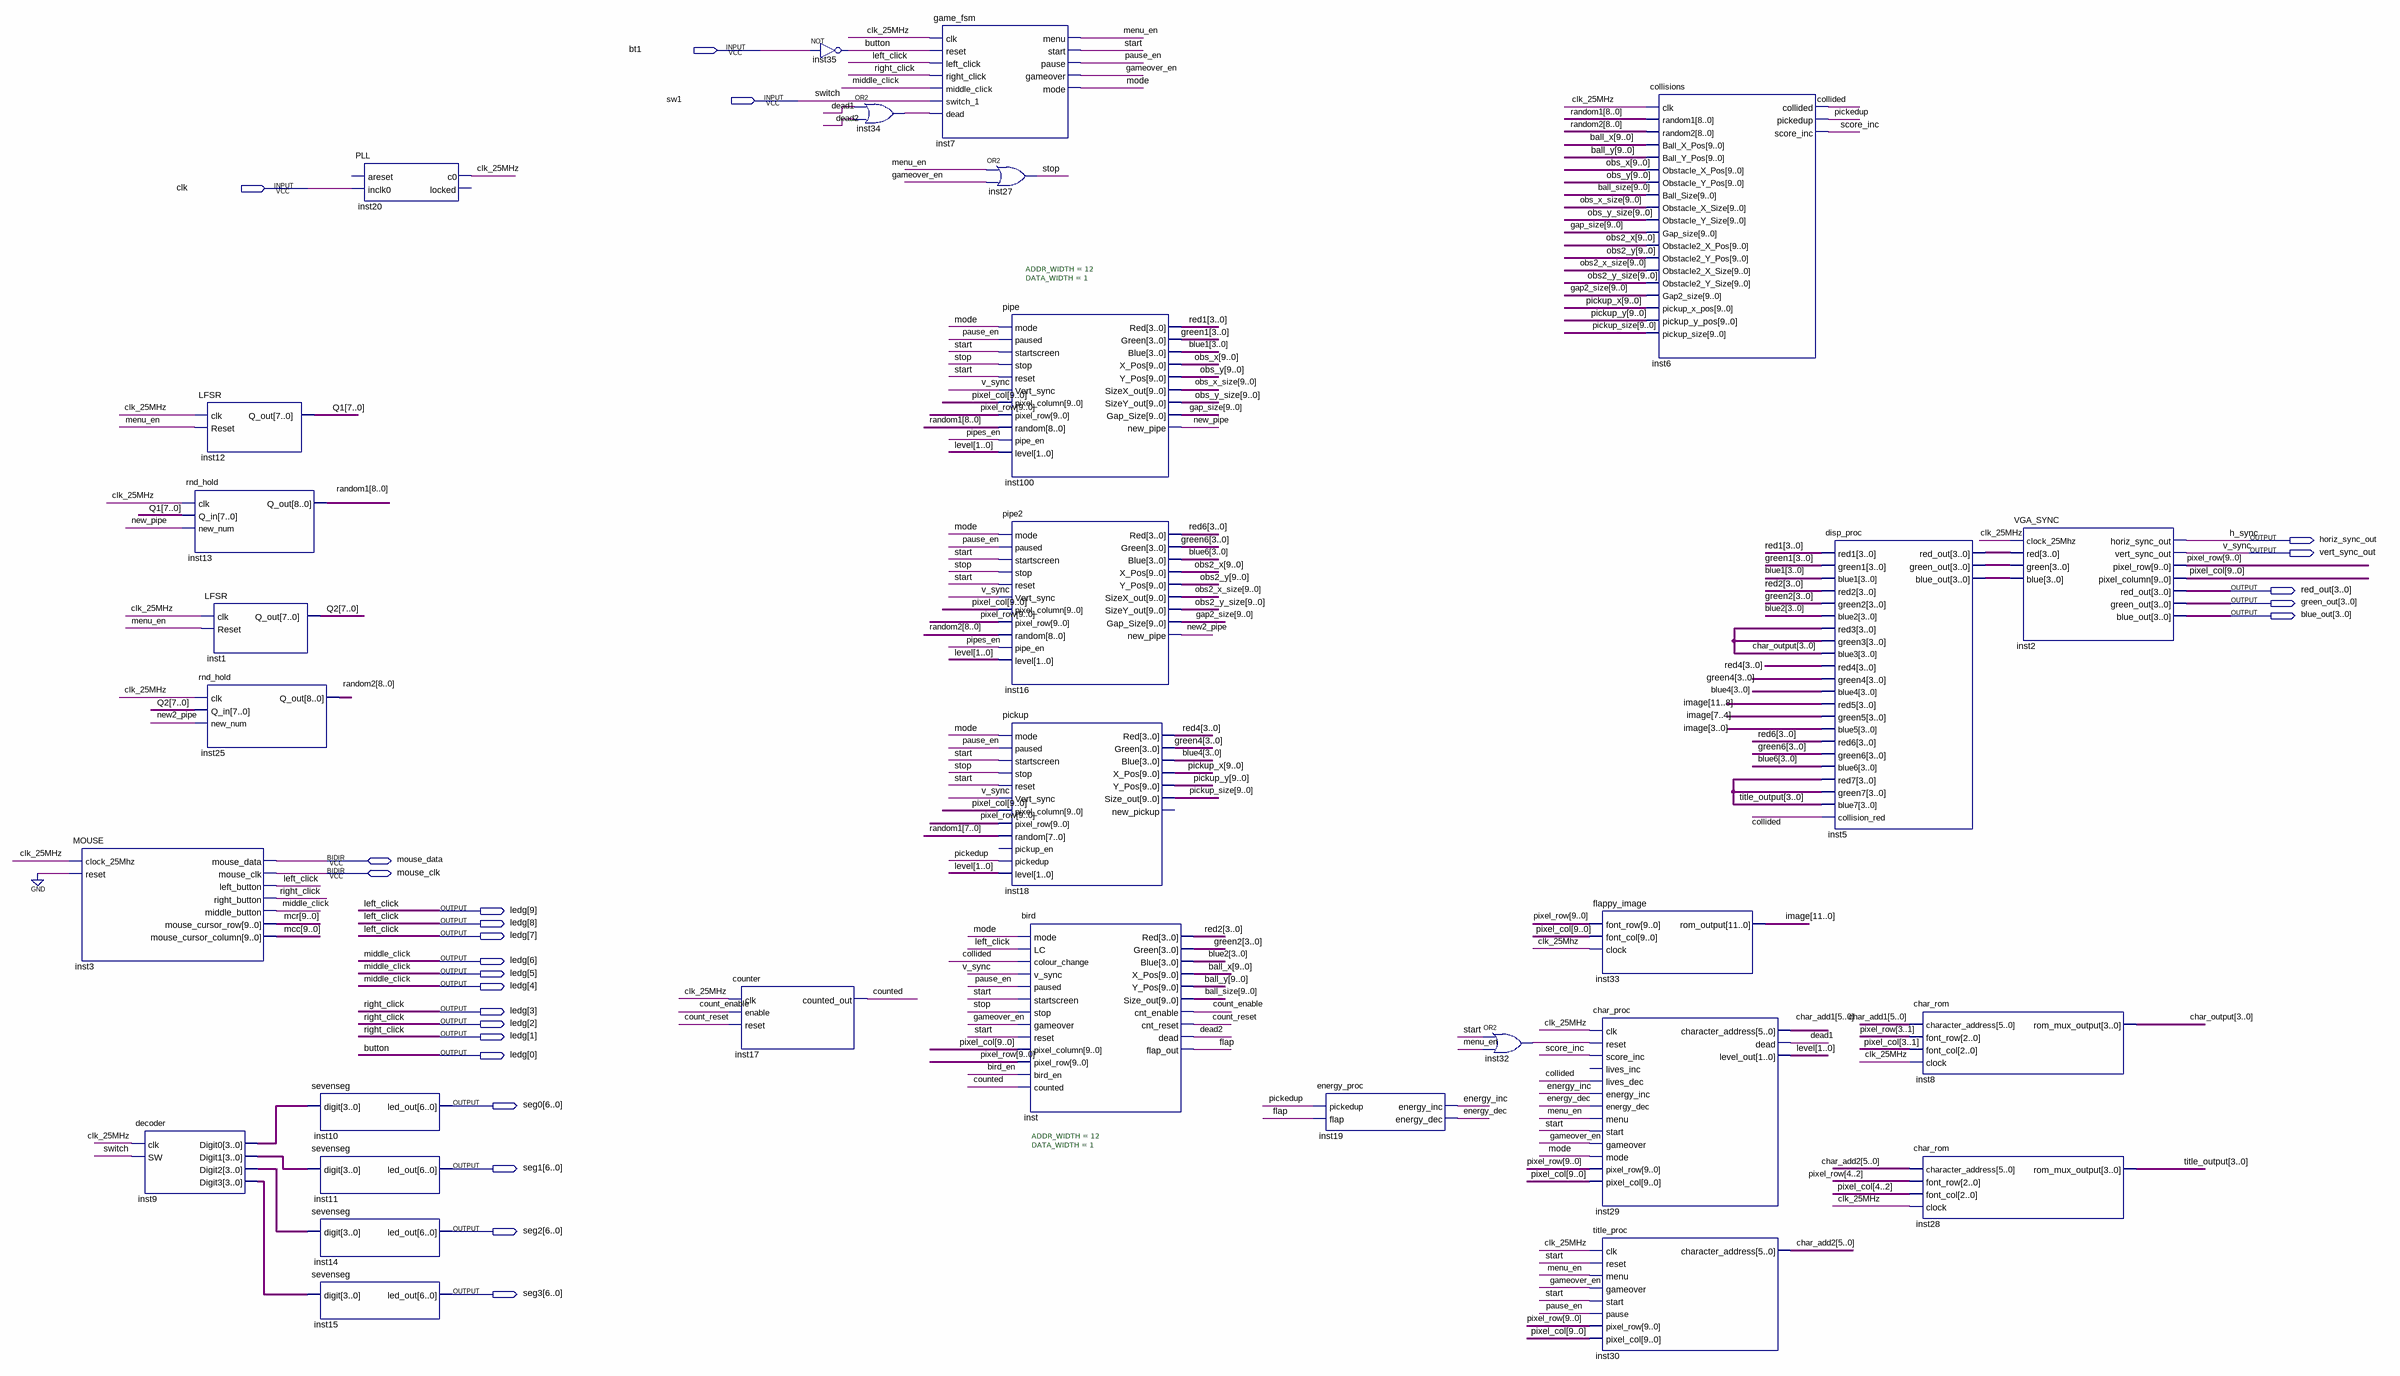
[diagram p0: schematic sheet]
// Quartus schematic AngryBird.bdf as structural Verilog: 30 symbols, 24 pins
module AngryBird (
  input  bt1,
  input  sw1,
  input  clk,
  inout  mouse_data,
  inout  mouse_clk,
  output horiz_sync_out,
  output vert_sync_out,
  output [3:0] red_out,
  output [3:0] green_out,
  output [3:0] blue_out,
  output [9:0] ledg,
  output [6:0] seg0,
  output [6:0] seg1,
  output [6:0] seg2,
  output [6:0] seg3
);

  wire bird_en, clk_25MHz, collided, count_enable, count_reset, counted, dead1, dead2, energy_dec,
       energy_inc, flap, gameover_en, inst32_out, inst34_out, menu_en, mode, new2_pipe, new_pipe, pause_en,
       pickedup, pipes_en, score_inc, start, stop;
  wire [1:0] level;
  wire [3:0] blue1, blue2, blue4, blue6, char_output, green1, green2, green4, green6, inst5_blue_out,
       inst5_green_out, inst5_red_out, inst9_digit0, inst9_digit1, inst9_digit2, inst9_digit3, red1, red2,
       red4, red6, title_output;
  wire [5:0] char_add1, char_add2;
  wire [7:0] Q1, Q2;
  wire [8:0] random1, random2;
  wire [9:0] ball_size, ball_x, ball_y, gap2_size, gap_size, mcc, mcr, obs2_x, obs2_x_size, obs2_y,
       obs2_y_size, obs_x, obs_x_size, obs_y, obs_y_size, pickup_size, pickup_x, pickup_y, pixel_col,
       pixel_row;
  wire [11:0] image;

  MOUSE inst3 (
    .clock_25Mhz(clk_25MHz), .reset(1'b0), .left_button(ledg[9]), .right_button(ledg[3]),
    .middle_button(ledg[6]), .mouse_cursor_row(mcr), .mouse_cursor_column(mcc), .mouse_data(mouse_data),
    .mouse_clk(mouse_clk));
  decoder inst9 (
    .clk(clk_25MHz), .SW(sw1), .Digit0(inst9_digit0), .Digit1(inst9_digit1), .Digit2(inst9_digit2),
    .Digit3(inst9_digit3));
  rnd_hold inst13 (.clk(clk_25MHz), .Q_in(Q1), .new_num(new_pipe), .Q_out(random1));
  LFSR inst12 (.clk(clk_25MHz), .Reset(menu_en), .Q_out(Q1));
  LFSR inst1 (.clk(clk_25MHz), .Reset(menu_en), .Q_out(Q2));
  rnd_hold inst25 (.clk(clk_25MHz), .Q_in(Q2), .new_num(new2_pipe), .Q_out(random2));
  sevenseg inst10 (.digit(inst9_digit0), .led_out(seg0));
  sevenseg inst11 (.digit(inst9_digit1), .led_out(seg1));
  sevenseg inst14 (.digit(inst9_digit2), .led_out(seg2));
  sevenseg inst15 (.digit(inst9_digit3), .led_out(seg3));
  PLL inst20 (.inclk0(clk), .c0(clk_25MHz));  // open: areset, locked
  counter inst17 (.clk(clk_25MHz), .enable(count_enable), .reset(count_reset), .counted_out(counted));
  not inst35 (ledg[0], bt1);
  or inst34 (inst34_out, dead1, dead2);
  game_fsm inst7 (
    .clk(clk_25MHz), .reset(ledg[0]), .left_click(ledg[9]), .right_click(ledg[3]), .middle_click(ledg[6]),
    .switch_1(sw1), .dead(inst34_out), .menu(menu_en), .start(start), .pause(pause_en),
    .gameover(gameover_en), .mode(mode));
  or inst27 (stop, menu_en, gameover_en);
  pipe #(.ADDR_WIDTH(12), .DATA_WIDTH(1)) inst100 (
    .mode(mode), .paused(pause_en), .startscreen(start), .stop(stop), .reset(start),
    .Vert_sync(vert_sync_out), .pixel_column(pixel_col), .pixel_row(pixel_row), .random(random1),
    .pipe_en(pipes_en), .level(level), .Red(red1), .Green(green1), .Blue(blue1), .X_Pos(obs_x),
    .Y_Pos(obs_y), .SizeX_out(obs_x_size), .SizeY_out(obs_y_size), .Gap_Size(gap_size), .new_pipe(new_pipe));
  pipe2 inst16 (
    .mode(mode), .paused(pause_en), .startscreen(start), .stop(stop), .reset(start),
    .Vert_sync(vert_sync_out), .pixel_column(pixel_col), .pixel_row(pixel_row), .random(random2),
    .pipe_en(pipes_en), .level(level), .Red(red6), .Green(green6), .Blue(blue6), .X_Pos(obs2_x),
    .Y_Pos(obs2_y), .SizeX_out(obs2_x_size), .SizeY_out(obs2_y_size), .Gap_Size(gap2_size),
    .new_pipe(new2_pipe));
  pickup inst18 (
    .mode(mode), .paused(pause_en), .startscreen(start), .stop(stop), .reset(start),
    .Vert_sync(vert_sync_out), .pixel_column(pixel_col), .pixel_row(pixel_row), .random(random1[7:0]),
    .pickedup(pickedup), .level(level), .Red(red4), .Green(green4), .Blue(blue4), .X_Pos(pickup_x),
    .Y_Pos(pickup_y), .Size_out(pickup_size));  // open: pickup_en, new_pickup
  bird #(.ADDR_WIDTH(12), .DATA_WIDTH(1)) inst (
    .mode(mode), .LC(ledg[9]), .colour_change(collided), .v_sync(vert_sync_out), .paused(pause_en),
    .startscreen(start), .stop(stop), .gameover(gameover_en), .reset(start), .pixel_column(pixel_col),
    .pixel_row(pixel_row), .bird_en(bird_en), .counted(counted), .Red(red2), .Green(green2), .Blue(blue2),
    .X_Pos(ball_x), .Y_Pos(ball_y), .Size_out(ball_size), .cnt_enable(count_enable), .cnt_reset(count_reset),
    .dead(dead2), .flap_out(flap));
  energy_proc inst19 (.pickedup(pickedup), .flap(flap), .energy_inc(energy_inc), .energy_dec(energy_dec));
  or inst32 (inst32_out, start, menu_en);
  flappy_image inst33 (.font_row(pixel_row), .font_col(pixel_col), .clock(clk_25MHz), .rom_output(image));
  char_proc inst29 (
    .clk(clk_25MHz), .reset(inst32_out), .score_inc(score_inc), .lives_dec(collided),
    .energy_inc(energy_inc), .energy_dec(energy_dec), .menu(menu_en), .start(start), .gameover(gameover_en),
    .mode(mode), .pixel_row(pixel_row), .pixel_col(pixel_col), .character_address(char_add1), .dead(dead1),
    .level_out(level));  // open: lives_inc
  title_proc inst30 (
    .clk(clk_25MHz), .reset(start), .menu(menu_en), .gameover(gameover_en), .start(start), .pause(pause_en),
    .pixel_row(pixel_row), .pixel_col(pixel_col), .character_address(char_add2));
  collisions inst6 (
    .clk(clk_25MHz), .random1(random1), .random2(random2), .Ball_X_Pos(ball_x), .Ball_Y_Pos(ball_y),
    .Obstacle_X_Pos(obs_x), .Obstacle_Y_Pos(obs_y), .Ball_Size(ball_size), .Obstacle_X_Size(obs_x_size),
    .Obstacle_Y_Size(obs_y_size), .Gap_size(gap_size), .Obstacle2_X_Pos(obs2_x), .Obstacle2_Y_Pos(obs2_y),
    .Obstacle2_X_Size(obs2_x_size), .Obstacle2_Y_Size(obs2_y_size), .Gap2_size(gap2_size),
    .pickup_x_pos(pickup_x), .pickup_y_pos(pickup_y), .pickup_size(pickup_size), .collided(collided),
    .pickedup(pickedup), .score_inc(score_inc));
  disp_proc inst5 (
    .red1(red1), .green1(green1), .blue1(blue1), .red2(red2), .green2(green2), .blue2(blue2),
    .red3(char_output), .green3(char_output), .blue3(char_output), .red4(red4), .green4(green4),
    .blue4(blue4), .red5(image[11:8]), .green5(image[7:4]), .blue5(image[3:0]), .red6(red6), .green6(green6),
    .blue6(blue6), .red7(title_output), .green7(title_output), .blue7(title_output),
    .collision_red(collided), .red_out(inst5_red_out), .green_out(inst5_green_out), .blue_out(inst5_blue_out));
  char_rom inst8 (
    .character_address(char_add1), .font_row(pixel_row[3:1]), .font_col(pixel_col[3:1]), .clock(clk_25MHz),
    .rom_mux_output(char_output));
  char_rom inst28 (
    .character_address(char_add2), .font_row(pixel_row[4:2]), .font_col(pixel_col[4:2]), .clock(clk_25MHz),
    .rom_mux_output(title_output));
  VGA_SYNC inst2 (
    .clock_25Mhz(clk_25MHz), .red(inst5_red_out), .green(inst5_green_out), .blue(inst5_blue_out),
    .horiz_sync_out(horiz_sync_out), .vert_sync_out(vert_sync_out), .pixel_row(pixel_row),
    .pixel_column(pixel_col), .red_out(red_out), .green_out(green_out), .blue_out(blue_out));

  assign {ledg[8:7], ledg[5:4], ledg[2:1]} = {{2{ledg[9]}}, {2{ledg[6]}}, {2{ledg[3]}}};

  // Other names for the same wires on the sheet: button = ledg[0]; h_sync = horiz_sync_out; left_click = ledg[9];
  //   middle_click = ledg[6]; right_click = ledg[3]; switch = sw1; v_sync = vert_sync_out
endmodule
